# EAGLE design led board (EAGLE 5.00)
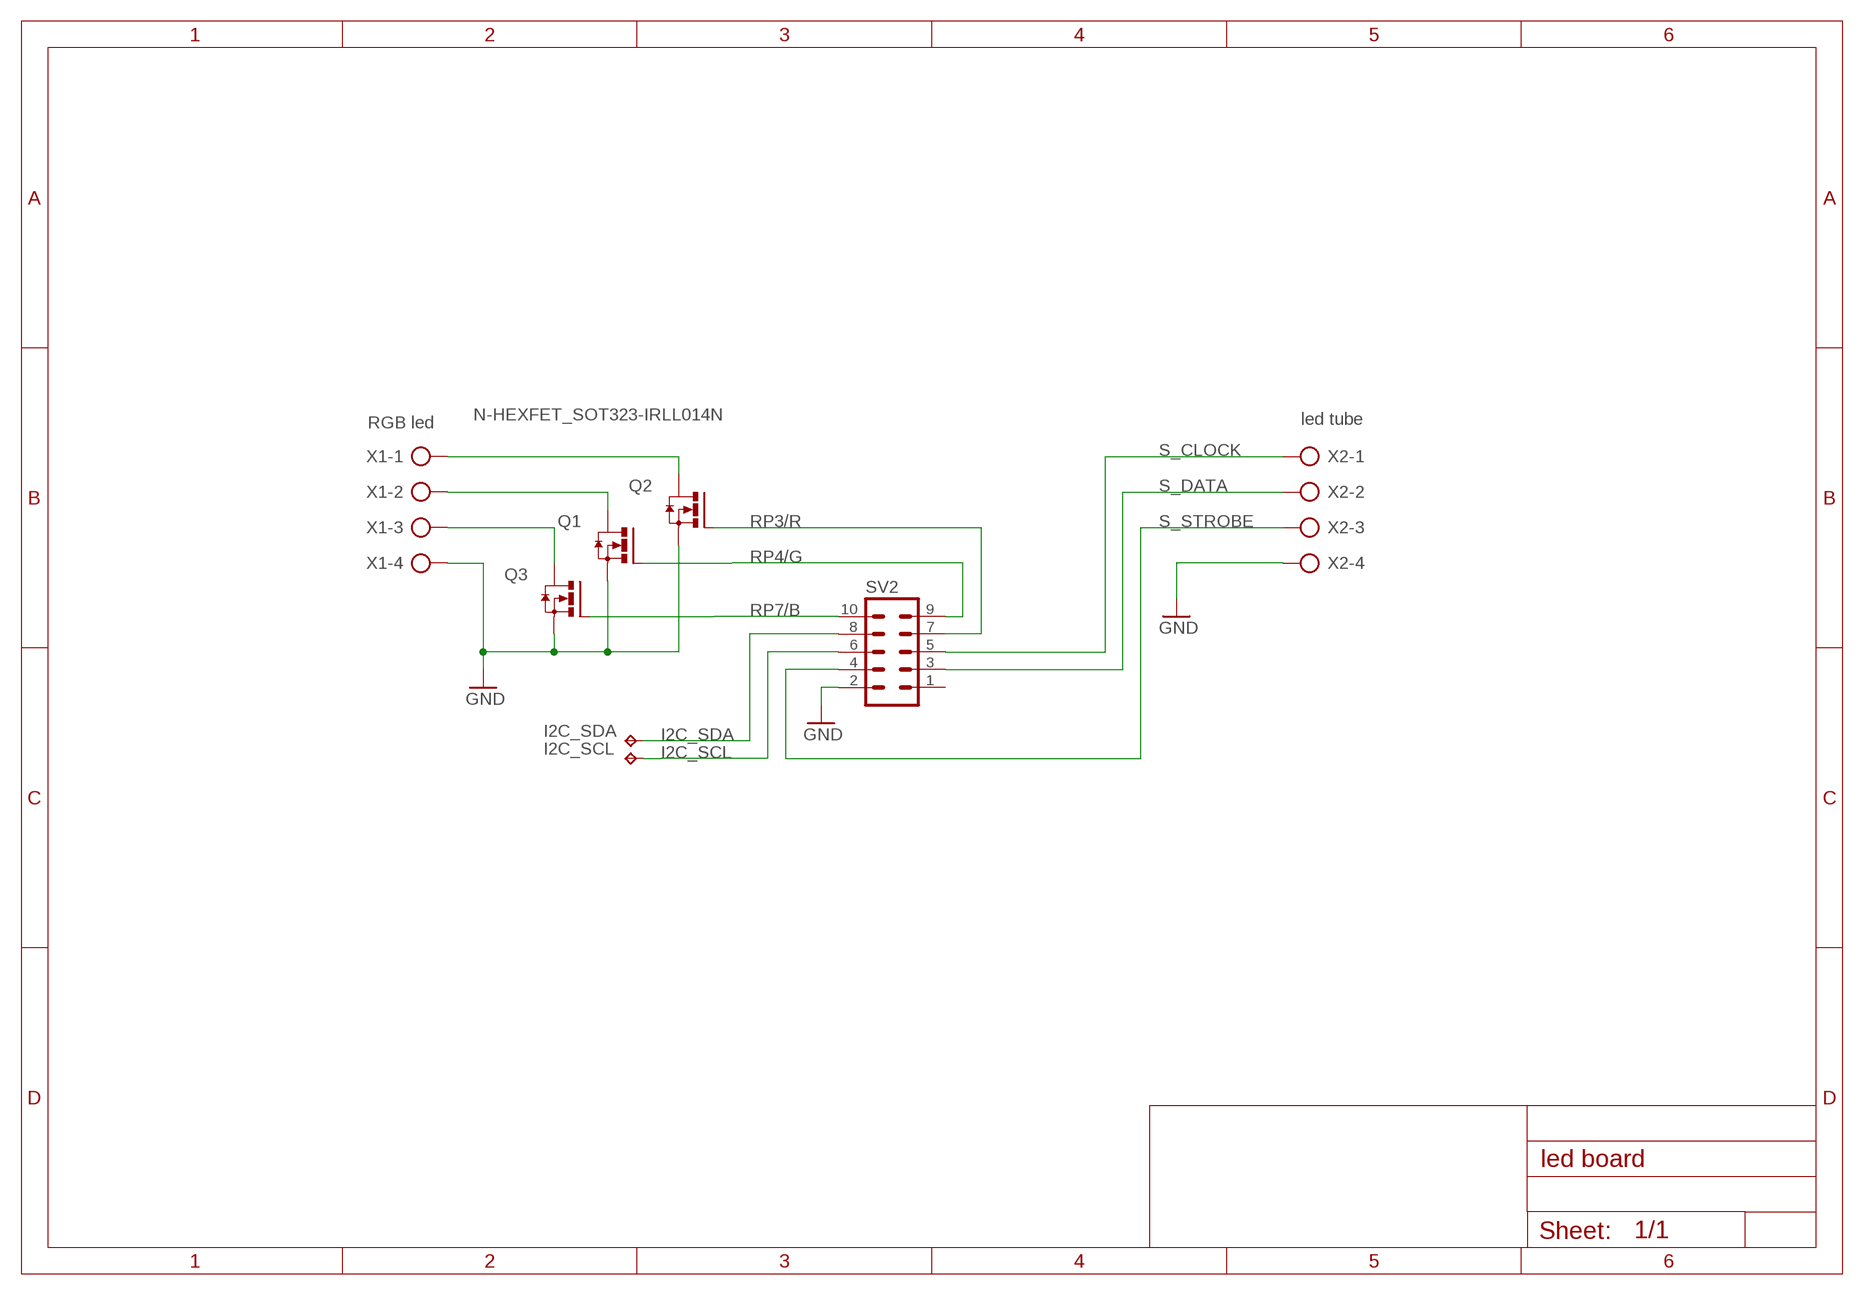
[diagram p0: schematic, sheet 1]

## Parts
I2C_SCL  TPPAD1-13  [P1-13]
I2C_SDA  TPPAD1-13  [P1-13]
Q1  N-HEXFET_SOT323-IRLL014N  [SOT223]
Q2  N-HEXFET_SOT323-IRLL014N  [SOT223]
Q3  N-HEXFET_SOT323-IRLL014N  [SOT223]
SV2  MA05-2  [MA05-2]
X1  RGB led  AK300/4  [AK300/4]
X2  led tube  AK300/4  [AK300/4]

## Nets
GND: Q1.3(S) Q2.3(S) Q3.3(S) SV2.2 X1.4 X2.4
I2C_SCL: I2C_SCL.1(TP) SV2.6
I2C_SDA: I2C_SDA.1(TP) SV2.8
N$2: Q3.4(D) X1.3
N$3: Q1.4(D) X1.2
N$4: Q2.4(D) X1.1
RP3/R: Q2.1(G) SV2.7
RP4/G: Q1.1(G) SV2.9
RP7/B: Q3.1(G) SV2.10
S_CLOCK: SV2.5 X2.1
S_DATA: SV2.3 X2.2
S_STROBE: SV2.4 X2.3
Unconnected: SV2.1

## Library data of the parts
I2C_SCL I2C_SDA = testpad:TP: Test pad
Q1-Q3 = transistor-power:N-HEXFET_?-*: HEXFET® Power MOSFET
SV2 = con-lstb:MA05-2: PIN HEADER
X1 X2 = con-ptr500:AK300/4: CONNECTOR

## Board
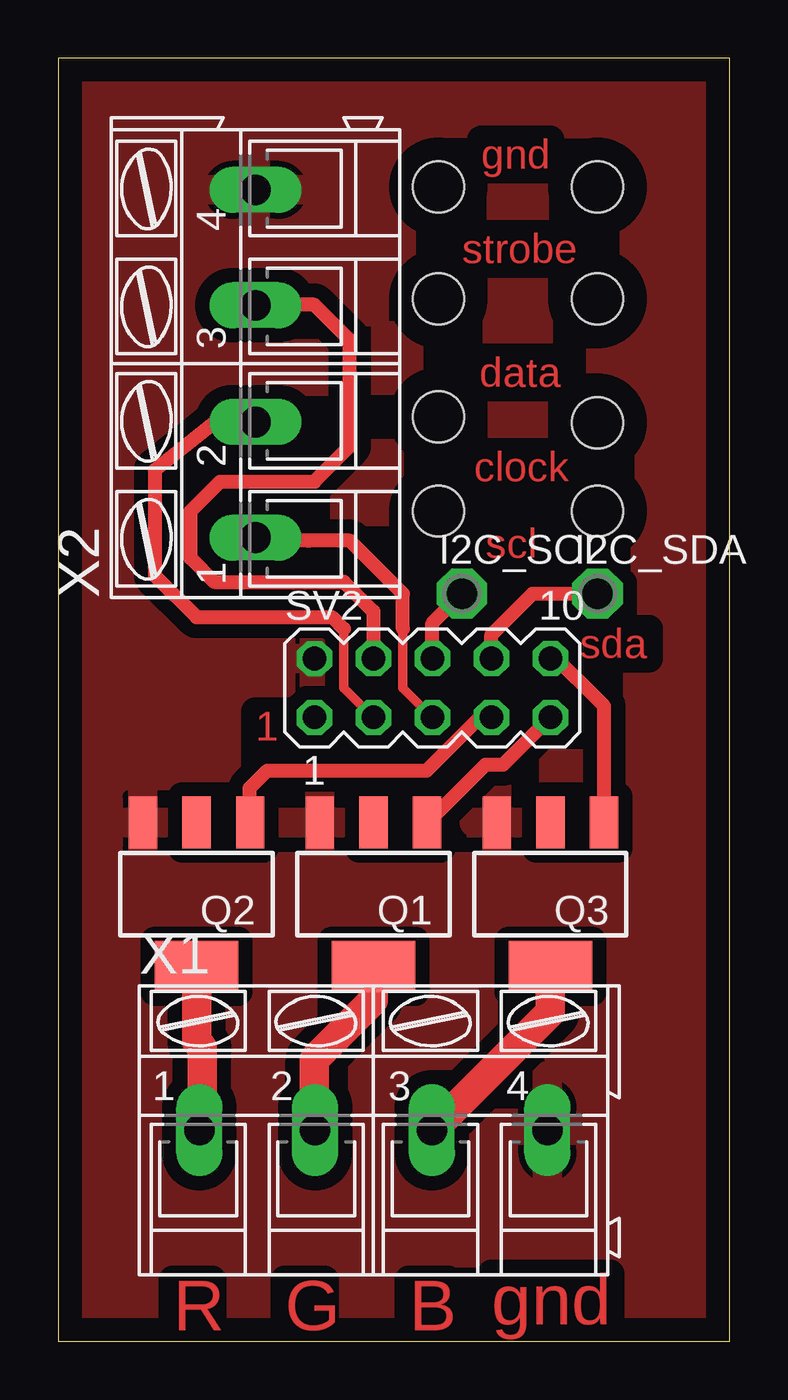
[diagram p1: board, top side]

Size 28.94 x 55.3 mm. Coordinates in mm from the lower left corner, seen from the top.
Outline: 0,0 28.94,0 28.94,55.3 0,55.3 0,0
Copper layers (1*16): Top 0.035mm / dielectric 1.5mm / Bottom 0.035mm
Design rules "default": minimum track width 10mil, minimum drill 24mil, track to track 8mil, track to pad 8mil, pad to pad 8mil, via to via 8mil, smd to smd 8mil, copper to edge 40mil, drill to drill 8mil, minimum pad ring 10mil, minimum via ring 8mil, stop-mask expansion 4mil, vias tented up to drill 0mil, thermal gap 10mil
Holes 2.2 mm at 16.38,49.75 16.38,44.92 16.38,39.84 16.38,35.78 23.24,35.78 23.24,39.59 23.24,44.92 23.24,49.75

### Footprints (pad centres in the part's own frame; a part is rotated, then mirrored left to right if it is on the bottom)
P1-13 = drill 1.321 pad 2.159 octagon: 1 0,0
SOT223 = smd 1.219 x 2.235: 1 -2.311,-3.099; 2 0,-3.099; 3 2.311,-3.099 | smd 3.6 x 2.2: 4 0,3.099
MA05-2 = drill 1.016 octagon: 1 -5.08,-1.27; 2 -5.08,1.27; 3 -2.54,-1.27; 4 -2.54,1.27; 5 0,-1.27; 6 0,1.27; 7 2.54,-1.27; 8 2.54,1.27; 9 5.08,-1.27; 10 5.08,1.27
AK300/4 = drill 1.321 long: 1 -7.493,0; 2 -2.515,0; 3 2.515,0; 4 7.493,0

### Placement (x,y rotation side)
I2C_SCL  17.39,32.22 0 top
I2C_SDA  23.24,32.22 0 top
Q1  13.58,19.27 180 top
Q2  5.96,19.27 180 top
Q3  21.2,19.27 180 top
SV2  16.12,28.16 0 top
X1  13.58,9.11 0 top
X2  8.5,42.13 90 top

### Tracks (layer width: path | path; a pad name or v marks a point on that pad's centre or on a via)
GND
  pour Top (isolate 0.61): -0.39,-0.8 -0.39,54.83 29.08,55.08 29.08,-0.55
I2C_SCL
  Top 0.61: SV2.6 16.12,30.95 I2C_SCL.1
I2C_SDA
  Top 0.61: SV2.8 18.66,30.44 20.44,32.22 I2C_SDA.1
N$2
  Top 1.27: X1.3 16.12,9.11 21.2,14.19 Q3.4
N$3
  Top 1.27: Q1.4 13.58,14.69 11.04,12.15 11.04,9.11 X1.2
N$4
  Top 1.27: Q2.4 5.96,12.92 6.22,12.66 6.22,8.85 6.09,8.98 X1.1
RP3/R
  Top 0.61: SV2.7 18.16,26.89 15.87,24.6 9.01,24.6 8.25,23.84 8.25,22.31 8.28,22.34 Q2.1
RP4/G
  Top 0.61: SV2.9 19.17,24.85 18.41,24.85 15.87,22.31 15.87,22.57 15.9,22.54 Q1.1
RP7/B
  Top 0.61: SV2.10 21.2,29.68 23.52,27.37 Q3.1
S_CLOCK
  Top 0.406: 14.85,30.7 14.85,28.41 14.85,28.16 SV2.5
  Top 0.61: X2.1 8.5,34.51 10.79,34.51 12.57,34.51 14.85,32.22 14.85,30.7
S_DATA
  Top 0.406: SV2.3 12.31,28.16 12.31,30.7
  Top 0.61: 12.31,30.7 11.81,31.2 5.96,31.2 4.19,32.98 4.19,37.55 6.73,39.59 8.5,39.59
  Top 0.813: 8.5,39.59 X2.2
S_STROBE
  Top 0.61: SV2.4 13.58,31.46 12.31,32.73 6.73,32.73 5.71,33.74 5.71,35.78 6.98,37.05 11.04,37.05 12.57,38.57 12.57,43.14 11.04,44.67 8.5,44.67 X2.3

### Text on the board
Top: gnd | strobe | data | clock | scl | sda | 1 | R | G | B | gnd